# Altium schematic sheet Sheet3.SchDoc
size A4
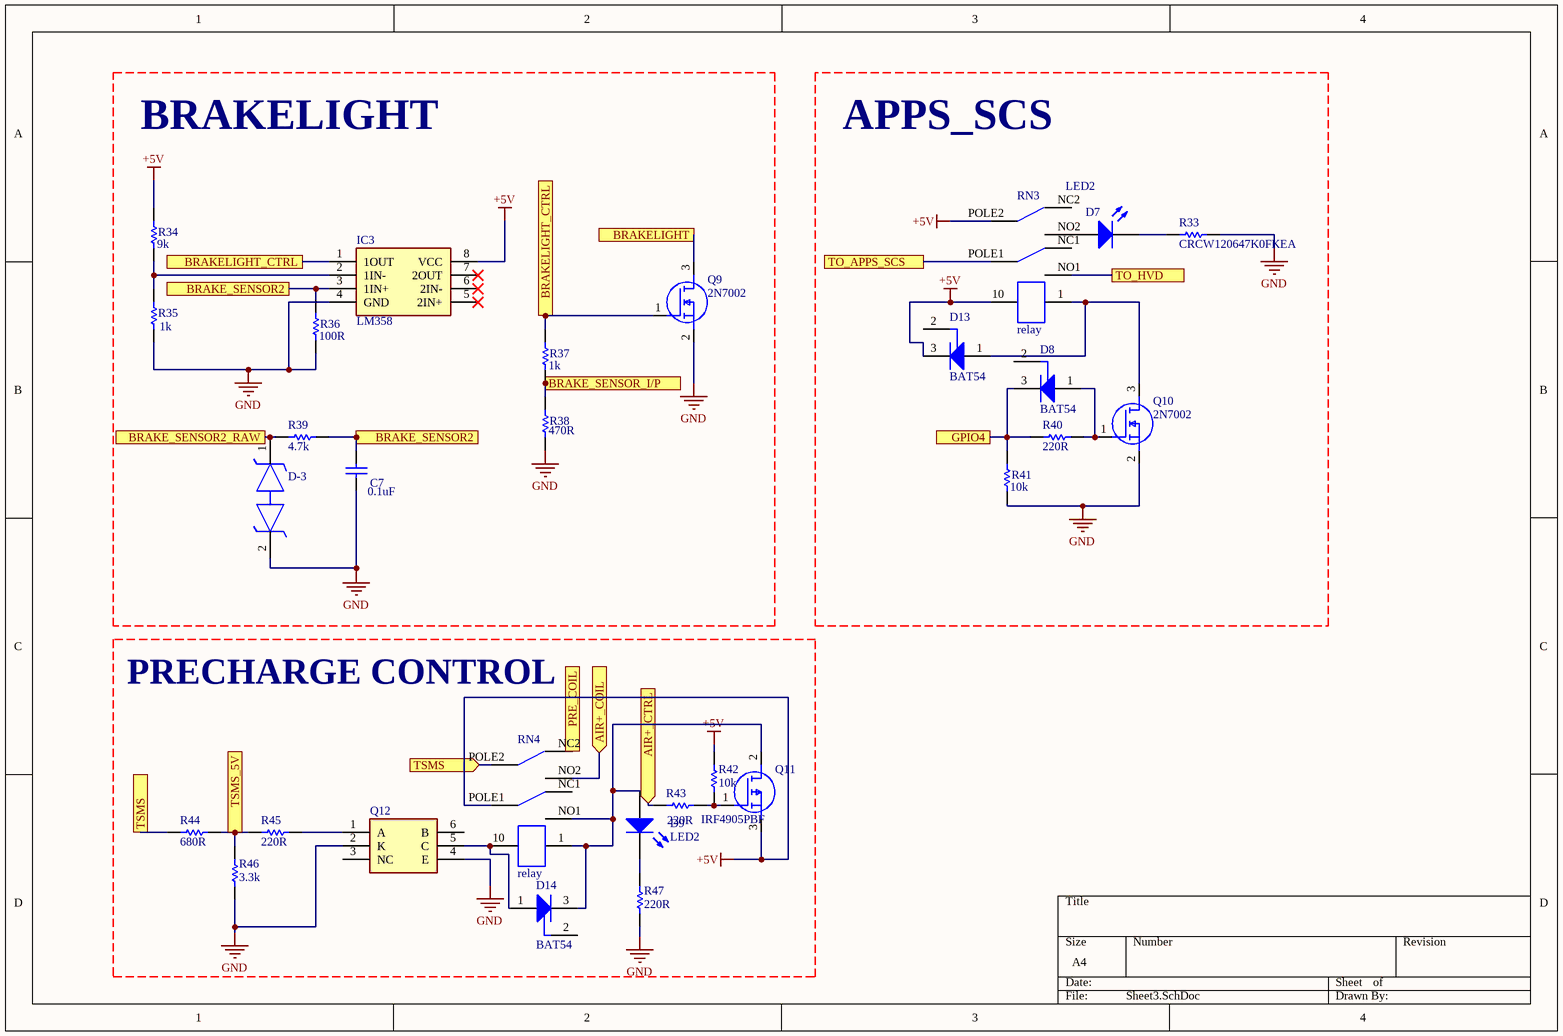
[diagram p0: Sheet3.SchDoc]

## Parts
C7  0.1uF  [KEMT-1206-2_N]
D7  LED2  [3.2X1.6X1.1]
D8  BAT54  [INF-SOT23_N]
D9  LED2  [3.2X1.6X1.1]
D13  BAT54  [INF-SOT23_N]
D14  BAT54  [INF-SOT23_N]
D-3  TPD1E6B06DPLR  [R1206]  (value not drawn)
IC3  LM358  [SOP100P600X150-8N]
Q9  2N7002  [SOT96P240X120-3N]
Q10  2N7002  [SOT96P240X120-3N]
Q11  IRF4905PBF  [TO254P469X1042X1967-3P]
Q12  MCT2ESM  [SOT254P916X480-6N]  (value not drawn)
R33  CRCW120647K0FKEA  [RESC3216X60X45NL10T20 - duplicate]
R34  9k  [RESC3216X60X45NL10T20 - duplicate]
R35  1k  [RESC3216X60X45NL10T20 - duplicate]
R36  100R  [RESC3216X60X45NL10T20 - duplicate]
R37  1k  [RESC3216X60X45NL10T20 - duplicate]
R38  470R  [RESC3216X60X45NL10T20 - duplicate]
R39  4.7k  [RESC3216X60X45NL10T20 - duplicate]
R40  220R  [RESC3216X60X45NL10T20 - duplicate]
R41  10k  [RESC3216X60X45NL10T20 - duplicate]
R42  10k  [R1206]
R43  220R  [R1206]
R44  680R  [RESC3216X60X45NL10T20 - duplicate]
R45  220R  [R1206]
R46  3.3k  [RESC3216X60X45NL10T20 - duplicate]
R47  220R  [R1206]
RN3  relay  [relaytq]
RN4  relay  [relaytq]

## Blocks framed on the sheet
BRAKELIGHT: C7 D-3 IC3 Q9 R34-R39
APPS_SCS: D7 D8 D13 Q10 R33 R40 R41 RN3
PRECHARGE CONTROL: D9 D14 Q11 Q12 R42-R47 RN4

## Ports
AIR+_COIL (in), AIR+_CTRL (in), BRAKE_SENSOR2, BRAKE_SENSOR2_RAW, BRAKE_SENSOR_I/P, BRAKELIGHT, BRAKELIGHT_CTRL, GPIO4, PRE_COIL, TO_APPS_SCS, TO_HVD, TSMS, TSMS (in), TSMS_5V

## Nets
+5V: D13.3(K) IC3.8(VCC) Q11.3(S) R34.2 R42.2 RN3.10 RN3.POLE2 RN4.POLE1
GND: C7.1 D-3.2 IC3.4(GND) Q9.2(S) Q10.2(S) Q12.2(K) Q12.4(E) R33.1 R35.1 R36.1 R38.1 R41.1 R46.1 R47.2
AIR+_COIL: RN4.NO2 ; port AIR+_COIL
AIR+_CTRL: R43.1 ; port AIR+_CTRL
BRAKE_SENSOR2: C7.2 IC3.3(1IN+) R36.2 R39.1 ; port BRAKE_SENSOR2
BRAKE_SENSOR2_RAW: D-3.1 R39.2 ; port BRAKE_SENSOR2_RAW
BRAKE_SENSOR_I/P: R37.1 R38.2 ; port BRAKE_SENSOR_I/P
BRAKELIGHT: Q9.3(D) ; port BRAKELIGHT
BRAKELIGHT_CTRL: IC3.1(1OUT) Q9.1(G) R37.2 ; port BRAKELIGHT_CTRL
GPIO4: D8.3(K) R40.2 R41.2 ; port GPIO4
PRE_COIL: RN4.NC2 ; port PRE_COIL
TO_APPS_SCS: RN3.POLE1 ; port TO_APPS_SCS
TO_HVD: RN3.NO1 ; port TO_HVD
TSMS: R44.2 RN4.POLE2 ; port TSMS
TSMS_5V: R44.1 R45.2 R46.2 ; port TSMS_5V
NetD7_1: D7.1(A) RN3.NO2
NetD7_2: D7.2(K) R33.2
NetD8_1: D8.1(A) Q10.1(G) R40.1
NetD9_1: D9.1(A) D14.3(K) Q11.2(D) RN4.1 RN4.NO1
NetD9_2: D9.2(K) R47.1
NetD13_1: D13.1(A) Q10.3(D) RN3.1
NetD14_1: D14.1(A) Q12.5(C) RN4.10
NetIC3_2: IC3.2(1IN-) R34.1 R35.2
NetQ11_1: Q11.1(G) R42.1 R43.2
NetQ12_1: Q12.1(A) R45.1

Not connected (* = marked no-connect by the designer): D8 2(NC); D13 2(NC); D14 2(NC); IC3 5(2IN+)* 6(2IN-)* 7(2OUT)*; Q12 3(NC) 6(B); RN3 NC1 NC2; RN4 NC1

## Library data of the parts
C7 = CAPACITOR: CAP, Ceramic, 0.1 uF, +/- 10%, 50 V, -55 to 125 degC, 1206 (3216 Metric), RoHS, Tape and Reel; Manufacturer: Kemet; Voltage Rating: 50V; Capacitance: 0.1µF; Product Range: KEMET-CSeries; SVHC: ToBeAdvised; Dielectric Characteristic: X7R; Capacitor Case Style: 1206[3216Metric]; Package Reference: 1206-2; Package Description: 2-Leads SMD, Body 3.2 x 1.6 mm; Packaging: Tape&Reel; Operating Temperature Max: 125degC; Capacitance Tolerance: ±10%; Datasheet URL: https://datasheet.ciiva.com/6125/1725438-6125494.pdf; Manufacturer URL: http://www.kemet.com/; Operating Temperature Min: -55degC; Datasheet Version: Jul-13
D7 D9 = LED2: Typical RED, GREEN, YELLOW, AMBER GaAs LED; Published: 8-Jun-2000; LatestRevisionDate: 17-Jul-2002; LatestRevisionNote: Re-released for DXP Platform.; PackageVersion: Feb-2002; PackageReference: 3.2X1.6X1.1; Publisher: Altium Limited; PackageDescription: SM LED; 2 Flat Leads
D8 D13 D14 = CMP-1182-00010-1: Silicon Schottky Diode, SOT23, Reel, Green; Manufacturer: Infineon; VF (max): 800Â mV; Configuration: Single; IF (max): 200Â mA; CT (max): 10Â pF; Green: TRUE; VR (max): 30Â V; PartNumber: BAT54; ComponentLink2URL: http://www.infineon.com/dgdl/bat54series.pdf?folderId=db3a30431400ef68011425f1ca2505e3&fileId=db3a304314dca3890115190b74210ea6; ComponentLink3Description: Package Specification; PackageVersion: Apr-08; PackageDescription: 3-Pin Small Outline Transistor Package, 1.3 x 2.9 mm Body, 0.95 mm Pitch; ComponentLink1Description: Manufacturer URL; ComponentLink1URL: http://www.infineon.com/; Mounting Technology: Surface Mount; Packing: Reel; ComponentLink2Description: Datasheet; PackageReference: SOT23; ComponentLink3URL: http://www.infineon.com/dgdl/SOT23-Package_Overview.pdf?folderId=db3a30431936bc4b0119532290053c66&fileId=db3a30431936bc4b0119533468123c85
IC3 = LM358: Integrated Circuit; Manufacturer_Name: IDCHIP; Datasheet Link: https://datasheet.lcsc.com/szlcsc/1902201702_IDCHIP-LM358_C329455.pdf; Height: 1.5mm; Manufacturer_Part_Number: LM358
Q9 Q10 = 2N7002: MOSFET (N-Channel); Manufacturer_Name: Vishay; Datasheet Link: https://www.diodes.com/assets/Datasheets/ds11303.pdf; Height: 1.2mm; Manufacturer_Part_Number: 2N7002; Mouser Part Number: 781-2N7002; Mouser Price/Stock: https://www.mouser.co.uk/ProductDetail/Vishay-Siliconix/2N7002?qs=xBpwZ0JX2zKeuvZKtdYLZQ%3D%3D
Q11 = IRF4905PBF: MOSFET (P-Channel); Manufacturer_Name: Infineon; Datasheet Link: http://docs-emea.rs-online.com/webdocs/0791/0900766b807910f2.pdf; Height: 4.69mm; Manufacturer_Part_Number: IRF4905PBF; Mouser Part Number: 942-IRF4905PBF; Mouser Price/Stock: https://www.mouser.co.uk/ProductDetail/Infineon-IR/IRF4905PBF/?qs=9%252BKlkBgLFf39l0HsWdxvdw%3D%3D; Arrow Part Number: IRF4905PBF; Arrow Price/Stock: https://www.arrow.com/en/products/irf4905pbf/infineon-technologies-ag
Q12 = MCT2ESM: Phototransistor; Manufacturer_Name: ON Semiconductor; Datasheet Link: https://www.onsemi.com/pub/Collateral/MCT2EM-D.PDF; Height: 4.8mm; Manufacturer_Part_Number: MCT2ESM; Mouser Part Number: 512-MCT2ESM; Mouser Price/Stock: https://www.mouser.co.uk/ProductDetail/ON-Semiconductor-Fairchild/MCT2ESM/?qs=nW0pe8qlIZjLnc6UyUzYTw%3D%3D; Arrow Part Number: MCT2ESM; Arrow Price/Stock: https://www.arrow.com/en/products/mct2esm/on-semiconductor
R33 = CMP-2003-02213-1: Manufacturer: Vishay Dale; Part Number: CRCW120647K0FKEA
R34-R41 R44 R46 = CMP-2003-02213-1: Part Number: CRCW120647K0FKEA; Manufacturer: Vishay Dale
R42 R43 R45 R47 = RES: Part Number: CRCW120647K0FKEA; Manufacturer: Vishay Dale